# EAGLE design QFP32_DIP (EAGLE 7.0.0)
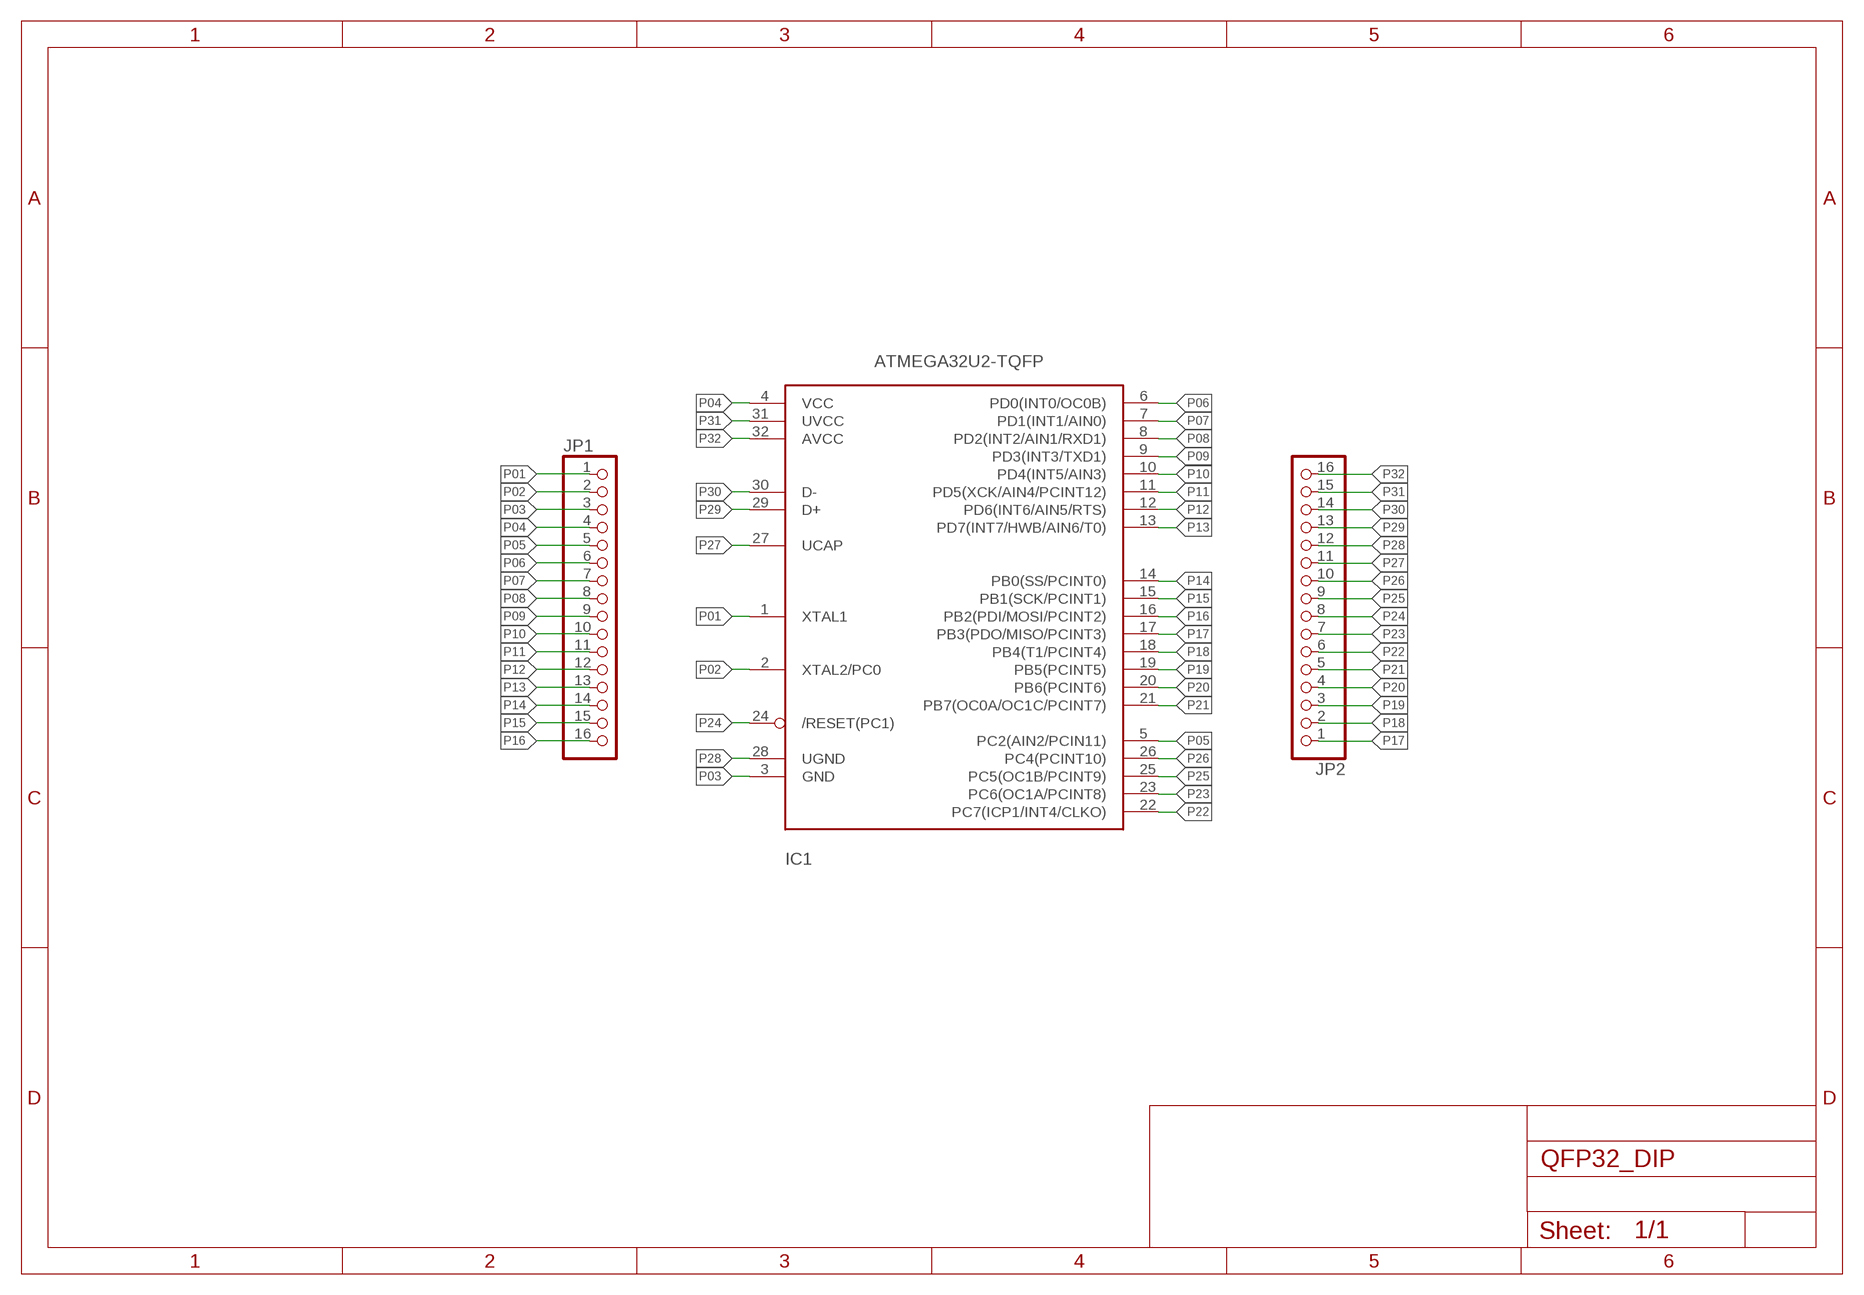
[diagram p0: schematic, sheet 1]

## Parts
IC1  ATMEGA32U2-TQFP  [TQFP32-08]
JP1  PINHD-1X16  [1X16]
JP2  PINHD-1X16  [1X16]

## Nets
P01: IC1.1(XTAL1) JP1.1
P02: IC1.2(XTAL2/PC0) JP1.2
P03: IC1.3(GND) JP1.3
P04: IC1.4(VCC) JP1.4
P05: IC1.5(PC2(AIN2/PCIN11)) JP1.5
P06: IC1.6(PD0(INT0/OC0B)) JP1.6
P07: IC1.7(PD1(INT1/AIN0)) JP1.7
P08: IC1.8(PD2(INT2/AIN1/RXD1)) JP1.8
P09: IC1.9(PD3(INT3/TXD1)) JP1.9
P10: IC1.10(PD4(INT5/AIN3)) JP1.10
P11: IC1.11(PD5(XCK/AIN4/PCINT12)) JP1.11
P12: IC1.12(PD6(INT6/AIN5/RTS)) JP1.12
P13: IC1.13(PD7(INT7/HWB/AIN6/T0)) JP1.13
P14: IC1.14(PB0(SS/PCINT0)) JP1.14
P15: IC1.15(PB1(SCK/PCINT1)) JP1.15
P16: IC1.16(PB2(PDI/MOSI/PCINT2)) JP1.16
P17: IC1.17(PB3(PDO/MISO/PCINT3)) JP2.1
P18: IC1.18(PB4(T1/PCINT4)) JP2.2
P19: IC1.19(PB5(PCINT5)) JP2.3
P20: IC1.20(PB6(PCINT6)) JP2.4
P21: IC1.21(PB7(OC0A/OC1C/PCINT7)) JP2.5
P22: IC1.22(PC7(ICP1/INT4/CLKO)) JP2.6
P23: IC1.23(PC6(OC1A/PCINT8)) JP2.7
P24: IC1.24(/RESET(PC1)) JP2.8
P25: IC1.25(PC5(OC1B/PCINT9)) JP2.9
P26: IC1.26(PC4(PCINT10)) JP2.10
P27: IC1.27(UCAP) JP2.11
P28: IC1.28(UGND) JP2.12
P29: IC1.29(D+) JP2.13
P30: IC1.30(D-) JP2.14
P31: IC1.31(UVCC) JP2.15
P32: IC1.32(AVCC) JP2.16

## Library data of the parts
IC1 = adafruit:ATMEGA32U2: ATmega32u2 Pin compatible with the atmega8u2, atmega16u2 and atmega32u2 8, 16 or 32 K flash, 1K RAM, 512b EEPROM 8 bit and 16 bit timer (5 PWM total) UART, SPI (no I2C!) USB with 4 endpoints, LUFA compatible 22 I/O lines, analog comparator (no ADC!) Comes with DFU bootloader burned in!
JP1 JP2 = pinhead:PINHD-1X16: PIN HEADER

## Board
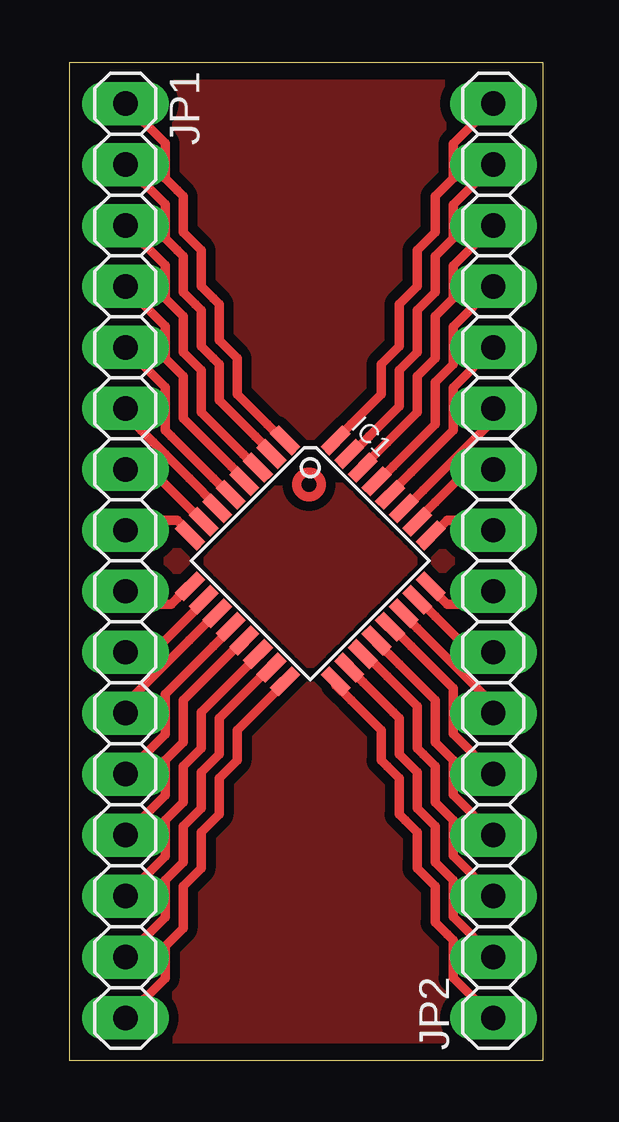
[diagram p1: board, top side]

Size 19.76 x 41.58 mm. Coordinates in mm from the lower left corner, seen from the top.
Outline: 0,0 19.76,0 19.76,41.58 0,41.58 0,0
Copper layers (1*16): Top 0.035mm / dielectric 1.5mm / Bottom 0.035mm
Design rules "toner_transfer": minimum track width 0.6mm, minimum drill 0.7mm, track to track 0.4mm, track to pad 0.4mm, pad to pad 0.35mm, via to via 0.4mm, smd to smd 8mil, copper to edge 0.7mm, drill to drill 0.5mm, minimum pad ring 0.4mm, minimum via ring 0.4mm, stop-mask expansion 4mil, vias tented up to drill 0mil, thermal gap 10mil

### Footprints (pad centres in the part's own frame; a part is rotated, then mirrored left to right if it is on the bottom)
TQFP32-08 = smd 1.27 x 0.508: 1 -4.293,2.8; 2 -4.293,2; 3 -4.293,1.2; 4 -4.293,0.4; 5 -4.293,-0.4; 6 -4.293,-1.2; 7 -4.293,-2; 8 -4.293,-2.8; 17 4.293,-2.8; 18 4.293,-2; 19 4.293,-1.2; 20 4.293,-0.4; 21 4.293,0.4; 22 4.293,1.2; 23 4.293,2; 24 4.293,2.8 | smd 0.508 x 1.27: 9 -2.8,-4.293; 10 -2,-4.293; 11 -1.2,-4.293; 12 -0.4,-4.293; 13 0.4,-4.293; 14 1.2,-4.293; 15 2,-4.293; 16 2.8,-4.293; 25 2.8,4.293; 26 2,4.293; 27 1.2,4.293; 28 0.4,4.293; 29 -0.4,4.293; 30 -1.2,4.293; 31 -2,4.293; 32 -2.8,4.293
1X16 = drill 1.016 long: 1 -19.05,0; 2 -16.51,0; 3 -13.97,0; 4 -11.43,0; 5 -8.89,0; 6 -6.35,0; 7 -3.81,0; 8 -1.27,0; 9 1.27,0; 10 3.81,0; 11 6.35,0; 12 8.89,0; 13 11.43,0; 14 13.97,0; 15 16.51,0; 16 19.05,0

### Placement (x,y rotation side)
IC1  10.05,20.82 315 top
JP1  2.35,20.82 270 top
JP2  17.68,20.82 90 top

### Tracks (layer width: path | path; a pad name or v marks a point on that pad's centre or on a via)
N$1
  pour Top: 0,0 0,41 0,41.5 19.5,41.5 20,41.5 20,0
P01
  Top 0.4: IC1.1 8.91,25.84 8.25,26.5 7,27.75 7,29.25 6.25,30 6.25,31.5 6,31.75 5.5,32.25 5.5,33.75 4.75,34.5 4.75,36 4.5,36.25 4,36.75 4,38.22 JP1.1
P02
  Top 0.4: IC1.2 8.43,25.32 7.75,26 6.25,27.5 6.25,29 6,29.25 5.5,29.75 5.5,31.25 5.25,31.5 4.75,32 4.75,33.5 4.5,33.75 4,34.25 4,35.67 JP1.2
P03
  Top 0.4: IC1.3 7.8,24.7 7.25,25.25 5.5,27 5.5,28.75 4.75,29.5 4.75,31 4,31.75 4,33.13 JP1.3
P04
  Top 0.4: IC1.4 7.3,24.2 6.75,24.75 4.75,26.75 4.75,28.25 4.75,28.5 4,29.25 4,30.59 JP1.4
P05
  Top 0.4: IC1.5 6.68,23.57 6,24.25 4.25,26 4,26.25 4,28.05 JP1.5
P06
  Top 0.4: IC1.6 6.17,23.08 5,24.25 4,25.25 3.5,25.75 3,26.25 2.75,26.5 2.5,26.75 2.5,27.02 JP1.6
P07
  Top 0.4: IC1.7 5.56,22.44 3.5,24.5 2.48,24.5 JP1.7
P08
  Top 0.4: IC1.8 5.04,21.96 4.5,22.5 2.75,22.5 JP1.8
P09
  Top 0.4: IC1.9 5.01,19.77 4.5,19.25 4.25,19 2.9,19 JP1.9
P10
  Top 0.4: IC1.10 5.61,19.11 3.75,17.25 2.58,17.25 JP1.10
P11
  Top 0.4: IC1.11 6.13,18.63 5,17.5 2.5,15 2.5,14.62 JP1.11
P12
  Top 0.4: IC1.12 6.74,17.99 6,17.25 4,15.25 4,13.59 JP1.12
P13
  Top 0.4: IC1.13 7.25,17.5 4.75,15 4.75,13.25 4,12.5 4,11.04 JP1.13
P14
  Top 0.4: IC1.14 7.87,16.87 5.5,14.5 5.5,13 4.75,12.25 4.75,10.75 4,10 4,8.51 JP1.14
P15
  Top 0.4: IC1.15 8.37,16.37 6.25,14.25 6.25,12.75 5.5,12 5.5,10.5 4.75,9.75 4.75,8.25 4,7.5 4,5.96 JP1.15
P16
  Top 0.4: IC1.16 9,15.75 7,13.75 7,12.5 6.25,11.75 6.25,10.25 5.5,9.5 5.5,8 4.75,7.25 4.75,5.5 4,4.75 4,3.42 JP1.16
P17
  Top 0.4: IC1.17 11.11,15.64 11.75,15 13,13.75 13,12.5 13.25,12.25 13.75,11.75 13.75,10.25 14,10 14.5,9.5 14.5,8.25 14.5,8 15.25,7.25 15.25,5.75 15.75,5.25 16,5 16,3.44 JP2.1
P18
  Top 0.4: IC1.18 11.68,16.32 12.25,15.75 13.5,14.5 13.75,14.25 13.75,12.75 14.5,12 14.5,10.5 15.25,9.75 15.25,8.25 16,7.5 16,5.99 JP2.2
P19
  Top 0.4: IC1.19 12.31,16.94 13.25,16 14.5,14.75 14.5,13 14.75,12.75 15.25,12.25 15.25,11.25 15.25,10.75 16,10 16,8.53 JP2.3
P20
  Top 0.4: IC1.20 12.81,17.44 13.75,16.5 15.25,15 15.25,13.25 16,12.5 16,11.06 JP2.4
P21
  Top 0.4: IC1.21 13.43,18.07 14.25,17.25 16,15.5 16,13.61 JP2.5
P22
  Top 0.4: IC1.22 13.94,18.56 14.5,18 17.5,15 17.5,14.64 JP2.6
P23
  Top 0.4: IC1.23 14.55,19.2 15.25,18.5 16.75,17 17.66,17 JP2.7
P24
  Top 0.4: IC1.24 15.07,19.68 15.75,19 17.12,19 JP2.8
P25
  Top 0.4: IC1.25 15.12,21.88 15.75,22.5 17.27,22.5 JP2.9
P26
  Top 0.4: IC1.26 14.51,22.5 15.25,23.25 16.5,24.5 17.55,24.5 JP2.10
P27
  Top 0.4: IC1.27 14.01,23.01 14.75,23.75 17.5,26.5 17.5,27 JP2.11
P28
  Top 0.4: IC1.28 13.37,23.62 14.25,24.5 16,26.25 16,28.04 JP2.12
P29
  Top 0.4: IC1.29 12.89,24.14 13.5,24.75 15.25,26.5 15.25,28.25 16,29 16,30.57 JP2.13
P30
  Top 0.4: IC1.30 12.24,24.74 13.25,25.75 14.5,27 14.5,28.5 15.25,29.25 15.25,31 16,31.75 16,33.12 JP2.14
P31
  Top 0.4: IC1.31 11.77,25.27 12.5,26 13.75,27.25 13.75,28.75 14.5,29.5 14.5,31.25 15.25,32 15.25,33.5 16,34.25 16,35.66 JP2.15
P32
  Top 0.4: IC1.32 11.11,25.86 11.75,26.5 13,27.75 13,29 13.75,29.75 13.75,31.5 14.5,32.25 14.5,33.75 15.25,34.5 15.25,36 16,36.75 16,38.2 JP2.16
(copper drawn outside any net)
  shapes: Top circle x2